# Altium project ChassisPowerDistribution_B_2.0_RW.PrjPcb
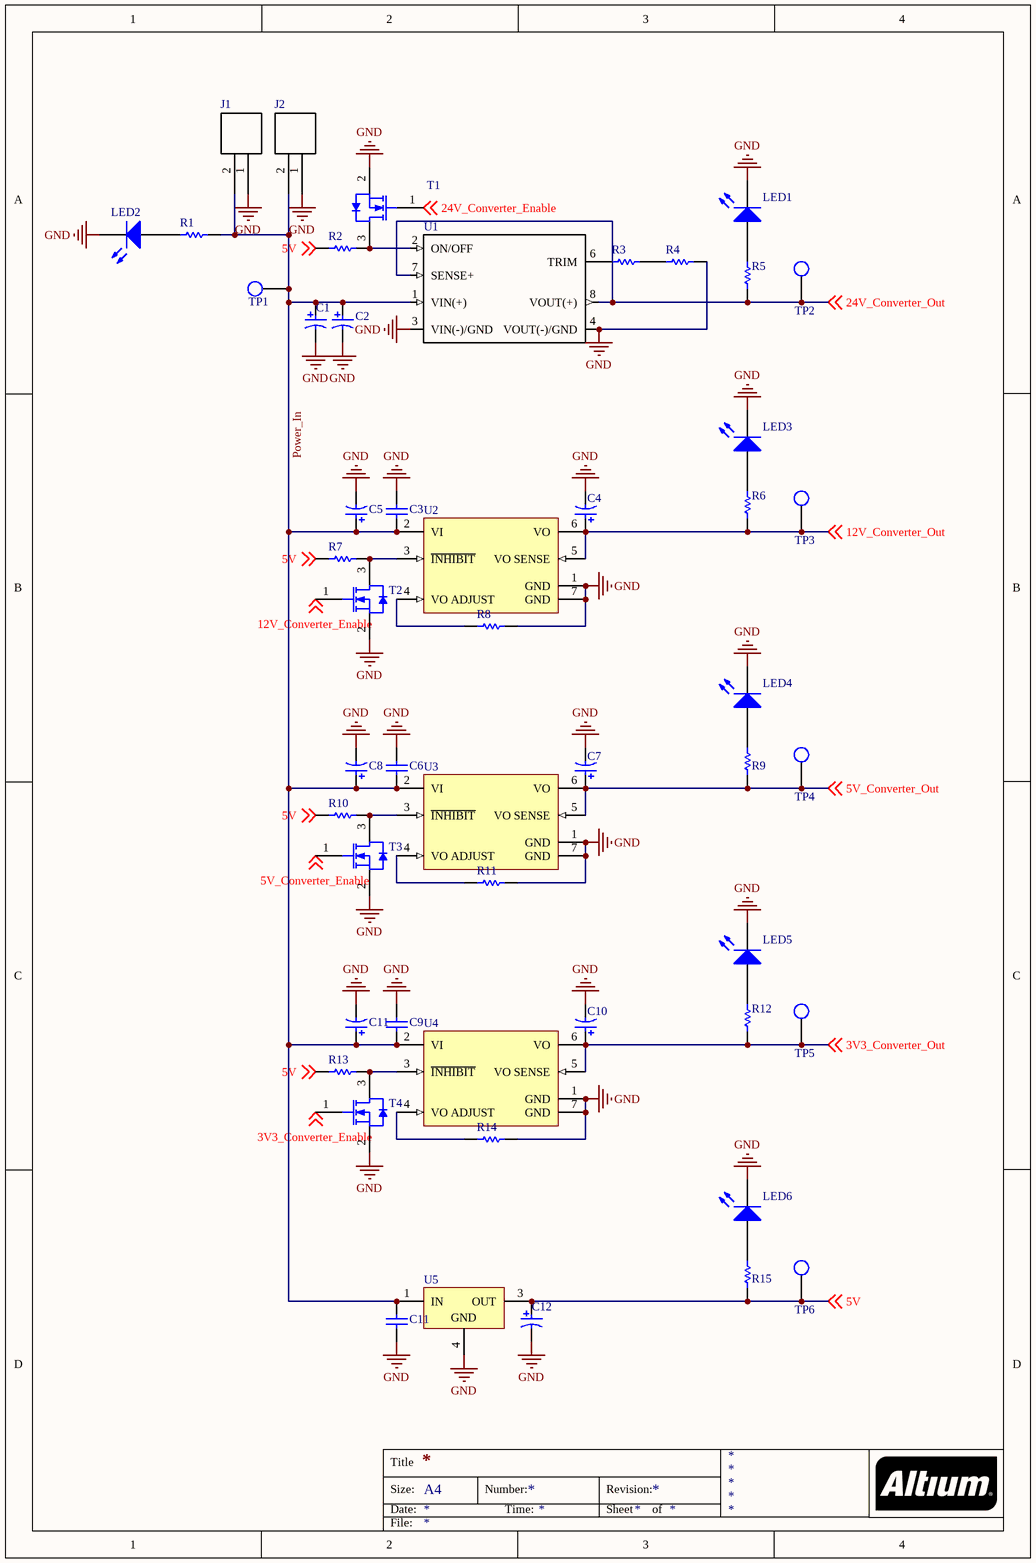
[diagram p0: Converters.SchDoc]
4 sheets, 101 parts. Net scope: global (net labels, ports and power ports of the same name join across sheets).
Sheets:
  Converters.SchDoc
  Current Sensors.SchDoc
  Microcontroller.SchDoc
  Output Connectors.SchDoc

## Sheet Converters.SchDoc
size A4 portrait

### Parts
(Parts that share a designator on the sheet are numbered #1, #2 ... from top to bottom, then left to right.)
C1  EEU-FC1V101  [*CAPPRD350W60D800H2000]  (value not drawn)
C2  ECA1HM100  [CAPPR55-200-1100X500X1200]  (value not drawn)
C3  2.2µF  [Cap 0805]  (value not drawn)
C4  EEU-FC1V331B  [*CAPPRD350W60D800H2000]  (value not drawn)
C5  ECA1HM100  [CAPPR55-200-1100X500X1200]  (value not drawn)
C6  2.2µF  [Cap 0805]  (value not drawn)
C7  EEU-FC1V331B  [*CAPPRD350W60D800H2000]  (value not drawn)
C8#1  ECA1HM100  [CAPPR55-200-1100X500X1200]  (value not drawn)
C9#1  2.2µF  [Cap 0805]  (value not drawn)
C10#1  EEU-FC1V331B  [*CAPPRD350W60D800H2000]  (value not drawn)
C11#1  ECA1HM100  [CAPPR55-200-1100X500X1200]  (value not drawn)
C11#2  0.1μF  [Cap 0805]  (value not drawn)
C12  EEU-FC1V101  [*CAPPRD350W60D800H2000]  (value not drawn)
J1  Super Saber  [Super Sabre]  (value not drawn)
J2  Super Saber  [Super Sabre]  (value not drawn)
LED1  Yellow LED  [0805_A]  (value not drawn)
LED2  Yellow LED  [0805_A]  (value not drawn)
LED3  Yellow LED  [0805_A]  (value not drawn)
LED4  Yellow LED  [0805_A]  (value not drawn)
LED5  Yellow LED  [0805_A]  (value not drawn)
LED6  Yellow LED  [0805_A]  (value not drawn)
R1  1.1k Ohm  [RESC0805(2012)_N]  (value not drawn)
R2  4.7k Ohm  [RESC0805(2012)_N]  (value not drawn)
R3  590 Ohm  [RESC0805(2012)_N]  (value not drawn)
R4  100 Ohm  [RESC0805(2012)_N]  (value not drawn)
R5#1  1.1k Ohm  [RESC0805(2012)_N]  (value not drawn)
R6  510 Ohm  [RESC0805(2012)_N]  (value not drawn)
R7#1  4.7k Ohm  [RESC0805(2012)_N]  (value not drawn)
R8  732 Ohm  [RESC0805(2012)_N]  (value not drawn)
R9  150 Ohm  [RESC0805(2012)_N]  (value not drawn)
R10#1  4.7k Ohm  [RESC0805(2012)_N]  (value not drawn)
R11  21k Ohm  [RESC0805(2012)_N]  (value not drawn)
R12  56 Ohm  [RESC0805(2012)_N]  (value not drawn)
R13#1  4.7k Ohm  [RESC0805(2012)_N]  (value not drawn)
R14  78.7k Ohm  [RESC0805(2012)_N]  (value not drawn)
R15  150 Ohm  [RESC0805(2012)_N]  (value not drawn)
T1  2N7002-7-F  [DIOD-SOT23-3_V]  (value not drawn)
T2  2N7002-7-F  [DIOD-SOT23-3_V]  (value not drawn)
T3  2N7002-7-F  [DIOD-SOT23-3_V]  (value not drawn)
T4  2N7002-7-F  [DIOD-SOT23-3_V]  (value not drawn)
TP1  Test Point  [Test Point Through-hole]  (value not drawn)
TP2  Test Point  [Test Point Through-hole]  (value not drawn)
TP3  Test Point  [Test Point Through-hole]  (value not drawn)
TP4  Test Point  [Test Point Through-hole]  (value not drawn)
TP5  Test Point  [Test Point Through-hole]  (value not drawn)
TP6  Test Point  [Test Point Through-hole]  (value not drawn)
U1#1  I6A4W020A033V-001-R  [*TDK-LAMBDA_I6A4W020A033V-001-R]  (value not drawn)
U2#1  PTN78020WAH  [EUK0007A]  (value not drawn)
U3  PTN78020WAH  [EUK0007A]  (value not drawn)
U4  PTN78020WAH  [EUK0007A]  (value not drawn)
U5#1  TL720M05QKVURQ1  [KVU0003A_M]  (value not drawn)

### Nets
GND: C1.2 C2.2 C3.2 C4.2 C5.2 C6.2 C7.2 C8#1.2 C9#1.2 C10#1.2 C11#1.2 C11#2.1 C12.2 J1.1 J2.1 LED1.1(K) LED2.1(K) LED3.1(K) LED4.1(K) LED5.1(K) LED6.1(K) R4.2 R8.2 R11.2 R14.2 T1.2(S) T2.2(S) T3.2(S) T4.2(S) U1#1.3(VIN(-)/GND) U1#1.4(VOUT(-)/GND) U2#1.1(GND) U2#1.7(GND) U3.1(GND) U3.7(GND) U4.1(GND) U4.7(GND) U5#1.4(GND)
3V3_Converter_Enable: T4.1(G) ; off-sheet 3V3_Converter_Enable
3V3_Converter_Out: C10#1.1 R12.1 TP5.1 U4.5(VO_SENSE) U4.6(VO) ; off-sheet 3V3_Converter_Out
5V: C12.1 R2.1 R7#1.1 R10#1.1 R13#1.1 R15.1 TP6.1 U5#1.3(OUT) ; off-sheet 5V
5V_Converter_Enable: T3.1(G) ; off-sheet 5V_Converter_Enable
5V_Converter_Out: C7.1 R9.1 TP4.1 U3.5(VO_SENSE) U3.6(VO) ; off-sheet 5V_Converter_Out
12V_Converter_Enable: T2.1(G) ; off-sheet 12V_Converter_Enable
12V_Converter_Out: C4.1 R6.2 TP3.1 U2#1.5(VO_SENSE) U2#1.6(VO) ; off-sheet 12V_Converter_Out
24V_Converter_Enable: T1.1(G) ; off-sheet 24V_Converter_Enable
24V_Converter_Out: R5#1.1 TP2.1 U1#1.7(SENSE+) U1#1.8(VOUT(+)) ; off-sheet 24V_Converter_Out
Power_In: C1.1 C2.1 C3.1 C5.1 C6.1 C8#1.1 C9#1.1 C11#1.1 C11#2.2 J1.2 J2.2 R1.2 TP1.1 U1#1.1(VIN(+)) U2#1.2(VI) U3.2(VI) U4.2(VI) U5#1.1(IN)
NetLED1_2: LED1.2(A) R5#1.2
NetLED2_2: LED2.2(A) R1.1
NetLED3_2: LED3.2(A) R6.1
NetLED4_2: LED4.2(A) R9.2
NetLED5_2: LED5.2(A) R12.2
NetLED6_2: LED6.2(A) R15.2
NetR2_2: R2.2 T1.3(D) U1#1.2(ON/OFF)
NetR3_1: R3.1 U1#1.6(TRIM)
NetR3_2: R3.2 R4.1
NetR7#1_2: R7#1.2 T2.3(D) U2#1.3(~{INHIBIT})
NetR8_1: R8.1 U2#1.4(VO_ADJUST)
NetR10#1_2: R10#1.2 T3.3(D) U3.3(~{INHIBIT})
NetR11_1: R11.1 U3.4(VO_ADJUST)
NetR13#1_2: R13#1.2 T4.3(D) U4.3(~{INHIBIT})
NetR14_1: R14.1 U4.4(VO_ADJUST)

### Notes on the sheet
- Title
- Size:
- Date:
- A4
- Number:
- Time:
- Revision:
- Sheet
- of
- File:

### Library data of the parts
C1 C12 = PNSC-CAP-P-2: Aluminum Electrolytic Capacitor, 100 uF +/- 20%, 35 V, -55 to 105 degC, 2-Pin 8 x 8 x 11.5 mm Through-hole, RoHS, Tape and Reel; Manufacturer: Panasonic; Ripple Current: 555 mA; Rated Voltage: 35 V; Cap.: 100 uF; Capacitance Tolerance: +/- 20%; ComponentLink2URL: http://industrial.panasonic.com/www-cgi/jvcr13pz.cgi?E+PZ+3+ABA0022+EEUFC1V101+7+WW; Mounting Technology: Through Hole; ComponentLink3URL: http://industrial.panasonic.com/www-data/pdf/ABA0000/ABA0000PE245.pdf; ComponentLink2Description: Datasheet; PartNumber: EEU-FC1V101; PackageDescription: 2-Pin Through-hole, Base 8 x 8 mm, Height 11.5 mm; PackageReference: EEU-FC1V101; ComponentLink1URL: http://industrial.panasonic.com/; Temp. Range: -55 to 105 degC; RoHS: TRUE; Packing: Tape and Reel; ComponentLink1Description: Manufacturer URL; ComponentLink3Description: Package Specification
C2 C5 C8#1 C11#1 = CMP-2100-03622-1: Aluminum Electrolytic Capacitor, 10 uF, +/- 20%, 50 V, -40 to 85 degC, 2-Pin THD, RoHS, Bulk; Manufacturer: Panasonic; Life (Hours): 2000Hour; Lead/Base Style: Straight; Dissipation Factor: 0.12%; Capacitance: 10uF; Leakage Current: 3uA; Dielectric Material: Aluminium; Lead Diameter: 0.5mm; Voltage Rating: 50V; Ripple Current: 65mA; Package Reference: CAPPR55-200-1100X500X1200; Height: 11mm; Diameter: 5mm; REACH SVHC: NoSVHC; Mount: ThroughHole; Packaging: Bulk; Manufacturer URL: http://www.panasonic.com/; Termination: Radial; Datasheet URL: https://industrial.panasonic.com/cdbs/www-data/pdf/RDF0000/ABA0000C1218.pdf; Lead Free: LeadFree; Height - Seated (Max): 0.472inch; Case/Package: Radial; Package Description: 2-Pin Radial Lead, Dia 5 mm, Height 12 mm; Tolerance: 20%; Datasheet Version: Rev. 05, 10/2016; Package Quantity: 200; Ripple Current (AC): 65mA; Min Operating Temperature: -40degC; RoHSCompliant: true; Number of Pins: 2; Max Operating Temperature: 85degC; Voltage: 50V; Lead Pitch: 2mm; Radiation Hardening: No; Voltage Rating (DC): 50V; Length: 11mm
C3 C6 C9#1 = Capacitor 0805: Standard Capacitor; Manufacturer: AVX; Tolerance (%): ±10%; Dielectric: X5R; Rated Voltage: 10V; Datasheet Version: 05/2016; Manufacturer URL: http://www.avx.com/; Package Description: 2-Pin Surface Mount Device, Body 2.01 x 1.25 mm; Mounting Technology: SurfaceMount; Case Size/Dimension: 0805; Package Reference: 0805; Capacitance: 2.2µF; Datasheet URL: http://datasheets.avx.com/cx5r.pdf
C4 C7 C10#1 = PNSC-CAP-P-2: Aluminum Electrolytic Capacitor, 330 uF +/- 20%, 35 V, -55 to 105 degC, 2-Pin 10 x 10 x 17 mm Through-hole, RoHS, Cut Tape; Manufacturer: Panasonic; Ripple Current: 1.05 A; Rated Voltage: 35 V; Cap.: 330 uF; Capacitance Tolerance: +/- 20%; ComponentLink2URL: http://industrial.panasonic.com/www-cgi/jvcr13pz.cgi?E+PZ+3+ABA0022+EEUFC1V101+7+WW; Mounting Technology: Through Hole; ComponentLink3URL: http://industrial.panasonic.com/www-data/pdf/ABA0000/ABA0000PE245.pdf; ComponentLink2Description: Datasheet; PartNumber: EEU-FC1V331B; PackageDescription: 2-Pin Through-hole, Base 10 x 10 mm, Height 17 mm; PackageReference: EEU-FC1V331B; ComponentLink1URL: http://industrial.panasonic.com/; Temp. Range: -55 to 105 degC; RoHS: TRUE; Packing: Cut Tape; ComponentLink1Description: Manufacturer URL; ComponentLink3Description: Package Specification
C11#2 = Capacitor 0805: Standard Capacitor; Mounting Technology: SurfaceMount; Case Size/Dimension: 0805; Package Reference: 0805; Capacitance: 0.1μF
LED1-LED6 = LED: Standard 0805 LED; PackageReference: 0805_A; Color: Yellow
R1-R4 R5#1 R6 R7#1 R8 R9 R10#1 R11 R13#1 R14 R15 = Resistor 0805: Generic 0805 Resistor; Case-EIA: 0805; Technology: SMT
  R1 R5#1: Value: 1.1k Ohm
  R2 R7#1 R10#1 R13#1: Value: 4.7k Ohm
  R3: Value: 590 Ohm
  R4: Value: 100 Ohm
  R6: Value: 510 Ohm
  R8: Value: 732 Ohm
  R9 R15: Value: 150 Ohm
  R11: Value: 21k Ohm
  R14: Value: 78.7k Ohm
R12 = Resistor 0805: Generic 0805 Resistor; Tolerance: 5 %; Case-EIA: 0805; Power: 0.125 W; Technology: SMT; Value: 56 Ohm
T1-T4 = CMP-2000-04929-1: N-Channel Enhancement Mode Field Effect Transistor, 60 V, 0.115 A, -55 to 150 degC, 3-Pin SOT23, RoHS, Tape and Reel; Id - Continuous Drain Current: 115mA; Typical Turn-On Delay Time: 7ns; Typical Turn-Off Delay Time: 11ns; Brand: DiodesIncorporated; Transistor Type: 1N-Channel; Vgs - Gate-Source Voltage: 20V; Rise Time: 3ns; Configuration: Single; Fall Time: 5.6ns; Vds - Drain-Source Breakdown Voltage: 70V; Rds On - Drain-Source Resistance: 7.5Ohms; Number of Channels: 1Channel; Forward Transconductance - Min: 0.08S; Pd - Power Dissipation: 300mW; Unit Weight: 0.000282oz; Datasheet URL: http://datasheet.octopart.com/2N7002-7-F-Diodes-Inc.-datasheet-8326113.pdf; Width: 1.3mm; Series: 2N7002; Length: 2.9mm; Product Category: MOSFET; Minimum Operating Temperature: -55C; Manufacturer URL: http://www.diodes.com/; Mounting Style: SMD/SMT; Package Reference: SOT23-3; Package Description: 3-Pin Small Outline Transistor, Body 2.9 x 1.3 mm, Pitch 0.96 mm; Maximum Operating Temperature: +150C; Transistor Polarity: N-Channel; Factory Pack Quantity: 3000; Technology: Si; Channel Mode: Enhancement; Datasheet Version: Rev. 21-2, 02/2009; Type: EnhancementModeFieldEffectTransistor; RoHS: True; Packaging: Reel; Package / Case: SOT-23-3; Height: 1mm; Product: MOSFETSmallSignal; Manufacturer: DiodesIncorporated
U1#1 = I6A4W020A033V-001-R: Dc-Dc, Pcb Mount, Sixteenth Brick, Input 24vdc, Output 3.3-15v 20a, 250w, Neg Logic; MF: TDK-Lambda Americas; SnapEDA_Link: https://www.snapeda.com/parts/I6A4W020A033V-001-R/TDK-Lambda%20Americas%20Inc./view-part/?ref=snap; Digi-Key_Part_Number: 285-2503-ND; MP: I6A4W020A033V-001-R; Package: DIP-7 TDK-Lambda; Digi-Key_Purchase_URL: https://www.digikey.com/product-detail/en/tdk-lambda-americas-inc/I6A4W020A033V-001-R/285-2503-ND/5878834?utm_source=snapeda&utm_medium=aggregator&utm_campaign=symbol; Value: *
U2#1 U3 U4 = CMP-0387-00547-2: 6 A Wide-Input Voltage Adjustable Switching Regulator, -40 to 85 degC, 7-pin Module (EUK7), Pb-Free (RoHS); Manufacturer: Texas Instruments; Vout(Min)(V): 2.5; Vin(Max)(V): 36; Vout(Max)(V): 12.6; Vin(Min)(V): 7; VO Adjustable: TRUE; SubFamily: Non-Isolated POL; Regulated Outputs(#): 1; Iout(Max)(A): 6; ComponentLink3Description: Package Specification; ComponentLink3URL: http://www.ti.com/litv/pdf/mpds185; PackageDescription: 7-Pin Plastic Special Shape, Body 22.1 x 37.97 mm; ComponentLink4URL: Samples URL:http://www.ti.com/product/ptn78020w#samples; DatasheetVersion: SLTS228C; ComponentLink2Description: Datasheet; ComponentLink4Description: URL Link1; ComponentLink1Description: Manufacturer URL; Mounting Technology: Through Hole; Eco-Plan: Pb-Free (RoHS); PartNumber: PTN78020WAH; PackageVersion: 4204986-2/C; ComponentLink2URL: http://www.ti.com/general/docs/lit/getliterature.tsp?genericPartNumber=PTN78020W&fileType=pdf; PackageReference: EUK0007A; ComponentLink1URL: http://www.ti.com/
U5#1 = CMP-0395-01074-2: Single Output Automotive LDO, 700 mA, Fixed 5 V Output, 5.5 to 42 V Input, 3-pin PFM (KVU), -40 to 125 degC, Green (RoHS & no Sb/Br); Manufacturer: Texas Instruments; Vin(Max)(V): 42; Vout Adj(Min)(V): 5; Vin(Min)(V): 5.5; Iq(Typ)(mA): 12; SubFamily: Single Channel LDO; Accuracy(%): 3; Vdo(Typ)(mV): 250; Iout(Max)(A): 0.7; Mounting Technology: Surface Mount; ComponentLink1Description: Manufacturer URL; Code_JEDEC: TO-252; ComponentLink3URL: http://www.ti.com/litv/pdf/mpsf018c; Fixed Output Options(V): 5; ComponentLink2URL: http://www.ti.com/general/docs/lit/getliterature.tsp?genericPartNumber=TL720M05-Q1&fileType=pdf; ComponentLink2Description: Datasheet; ComponentLink3Description: Package Specification; PackageReference: KVU0003A; PackageVersion: 4205521-2/D; PartNumber: TL720M05QKVURQ1; PackageDescription: 3-Pin Plastic Flange Mount, Body 6.1 x 6.6 mm, Pitch 2.29 mm; DatasheetVersion: SGLS380D; Eco-Plan: Green (RoHS & no Sb/Br); ComponentLink1URL: http://www.ti.com/; Vout Adj(Max)(V): 5

## Sheet Current Sensors.SchDoc
size A4
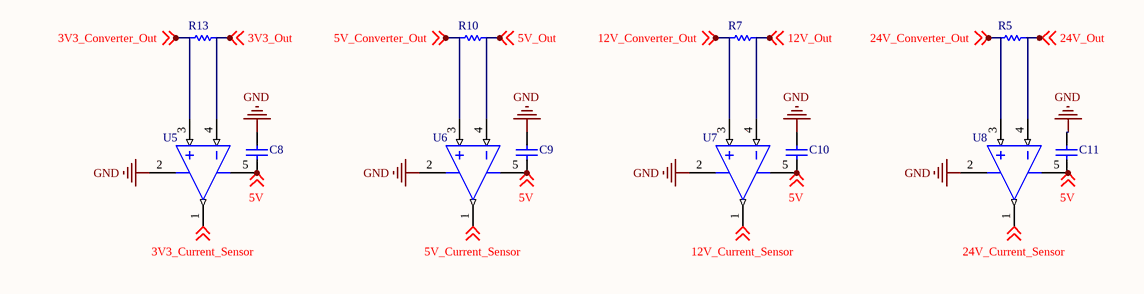
[diagram p1: Current Sensors.SchDoc]

### Parts
(Parts that share a designator on the sheet are numbered #1, #2 ... from top to bottom, then left to right.)
C8#2  0.1μF  [Cap 0805]  (value not drawn)
C9#2  0.1μF  [Cap 0805]  (value not drawn)
C10#2  0.1μF  [Cap 0805]  (value not drawn)
C11#3  0.1μF  [Cap 0805]  (value not drawn)
R5#2  10 mOhms  [RESC0805(2012)_N]  (value not drawn)
R7#2  15 mOhms  [RESC0805(2012)_N]  (value not drawn)
R10#2  20 mOhms  [RESC0805(2012)_N]  (value not drawn)
R13#2  25 mOhms  [RESC0805(2012)_N]  (value not drawn)
U5#2  INA194AIDBVR  [DBV0005A_L]  (value not drawn)
U6  INA194AIDBVR  [DBV0005A_L]  (value not drawn)
U7  INA194AIDBVR  [DBV0005A_L]  (value not drawn)
U8  INA194AIDBVR  [DBV0005A_L]  (value not drawn)

### Nets
GND: C8#2.2 C9#2.2 C10#2.2 C11#3.2 U5#2.2(GND) U6.2(GND) U7.2(GND) U8.2(GND)
3V3_Converter_Out: R13#2.1 U5#2.3(VIN+) ; off-sheet 3V3_Converter_Out
3V3_Current_Sensor: U5#2.1(OUT) ; off-sheet 3V3_Current_Sensor
3V3_Out: R13#2.2 U5#2.4(VIN-) ; off-sheet 3V3_Out
5V: C8#2.1 C9#2.1 C10#2.1 C11#3.1 U5#2.5(V+) U6.5(V+) U7.5(V+) U8.5(V+) ; off-sheet 5V
5V_Converter_Out: R10#2.1 U6.3(VIN+) ; off-sheet 5V_Converter_Out
5V_Current_Sensor: U6.1(OUT) ; off-sheet 5V_Current_Sensor
5V_Out: R10#2.2 U6.4(VIN-) ; off-sheet 5V_Out
12V_Converter_Out: R7#2.1 U7.3(VIN+) ; off-sheet 12V_Converter_Out
12V_Current_Sensor: U7.1(OUT) ; off-sheet 12V_Current_Sensor
12V_Out: R7#2.2 U7.4(VIN-) ; off-sheet 12V_Out
24V_Converter_Out: R5#2.1 U8.3(VIN+) ; off-sheet 24V_Converter_Out
24V_Current_Sensor: U8.1(OUT) ; off-sheet 24V_Current_Sensor
24V_Out: R5#2.2 U8.4(VIN-) ; off-sheet 24V_Out

### Notes on the sheet
- Title
- Size:
- Date:
- A4
- Number:
- Time:
- Revision:
- Sheet
- of
- File:

### Library data of the parts
C8#2 C9#2 C10#2 C11#3 = Capacitor 0805: Standard Capacitor; Mounting Technology: SurfaceMount; Case Size/Dimension: 0805; Package Reference: 0805; Capacitance: 0.1μF
R5#2 R7#2 R10#2 R13#2 = Resistor 0805: Generic 0805 Resistor; Case-EIA: 0805; Technology: SMT
  R5#2: Value: 10 mOhms
  R7#2: Value: 15 mOhms
  R10#2: Value: 20 mOhms
  R13#2: Value: 25 mOhms
U5#2 U6-U8 = TI-INA1XXDBV5: Voltage Output High-Side Measurement Current Shunt Monitor, 2.7 to 18 V, -40 to 125 degC, 5-pin SOT23 (DBV5), Green (RoHS & no Sb/Br); Manufacturer: Texas Instruments; Quiescent Current (+/-)(Typ)(mA): 0.7; Input Offset (+/-)(Max)(uV): 2000; Gain(V/V): 50; Vs(Min)(V): 2.7; Rating: Catalog; Small-Signal Bandwidth(Typ)(MHz): 0.3; CMRR(Min)(dB): 80; Common Mode Range(Min)(V): -16; Vs(Max)(V): 18; ComponentLink2Description: Datasheet; Eco-Plan: Green (RoHS & no Sb/Br); ComponentLink1URL: http://www.ti.com/; Code_JEDEC: MO-178; SubFamily: Current Shunt Monitor; ComponentLink3URL: http://www.ti.com/lit/ml/mpds018j/mpds018j.pdf; PackageVersion: 4073253-4/K, 03/2006; PartNumber: INA194AIDBVR; DatasheetVersion: SBOS307F; ComponentLink1Description: Manufacturer URL; ComponentLink3Description: Package Specification; Output Type: Voltage; Mounting Technology: Surface Mount; ComponentLink2URL: http://www.ti.com/general/docs/lit/getliterature.tsp?genericPartNumber=INA194&fileType=pdf; Common Mode Range(Max)(V): 80; PackageDescription: 5-Pin Plastic Small Outline, Body 1.6 x 2.9 mm, Pitch 0.95 mm; PackageReference: DBV0005A

## Sheet Microcontroller.SchDoc
size A
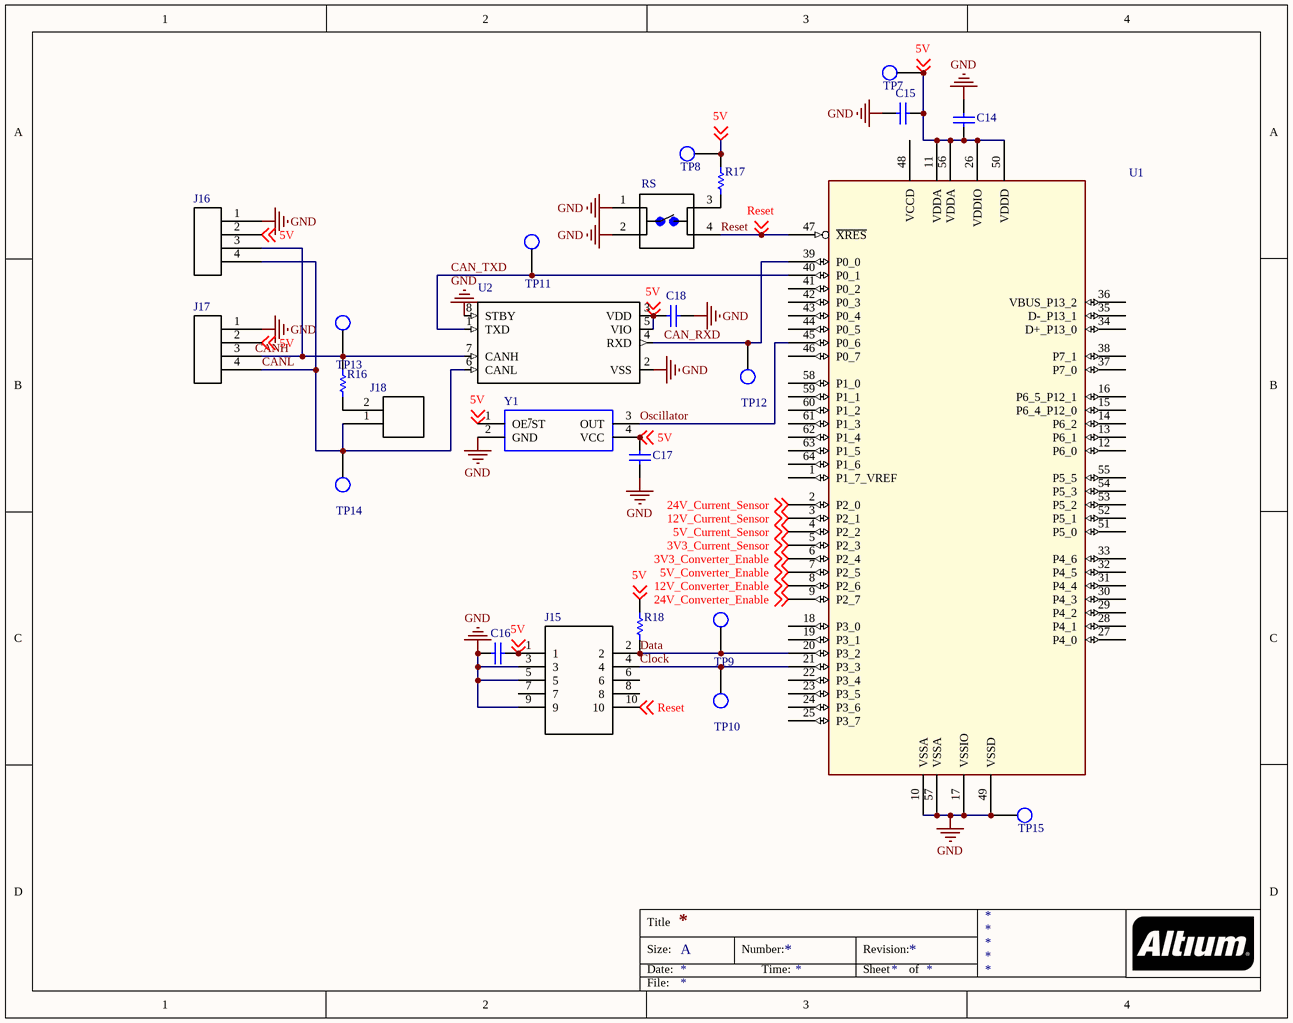
[diagram p2: Microcontroller.SchDoc]

### Parts
(Parts that share a designator on the sheet are numbered #1, #2 ... from top to bottom, then left to right.)
C14  10 μF  [Cap 0805]  (value not drawn)
C15  0.1 μF  [Cap 0805]  (value not drawn)
C16  0.1 μF  [Cap 0805]  (value not drawn)
C17  0.1 μF  [Cap 0805]  (value not drawn)
C18  0.1 μF  [Cap 0805]  (value not drawn)
J15  Programming Header  [programming]  (value not drawn)
J16  Molex Micro  [microfit 4 pin]  (value not drawn)
J17  Molex Micro  [microfit 4 pin]  (value not drawn)
J18  Molex micro-  [Microfit 2 pin]  (value not drawn)
R16  120R  [RESC0805(2012)_N]  (value not drawn)
R17  4.7 kOhm  [RESC0805(2012)_N]  (value not drawn)
R18  47 kOhm  [RESC0805(2012)_N]  (value not drawn)
RS  1825910-7  [Switch 6mm 24V (NO)]  (value not drawn)
TP7  Test Point  [Test Point Through-hole]  (value not drawn)
TP8  Test Point  [Test Point Through-hole]  (value not drawn)
TP9  Test Point  [Test Point Through-hole]  (value not drawn)
TP10  Test Point  [Test Point Through-hole]  (value not drawn)
TP11  Test Point  [Test Point Through-hole]  (value not drawn)
TP12  Test Point  [Test Point Through-hole]  (value not drawn)
TP13  Test Point  [Test Point Through-hole]  (value not drawn)
TP14  Test Point  [Test Point Through-hole]  (value not drawn)
TP15  Test Point  [Test Point Through-hole]  (value not drawn)
U1#2  CY8C4248AZI-L485  [TQFP50P1200X1200X160-64N]  (value not drawn)
U2#2  MCP2562-E/SN  [SOIC127P600X175-8N]  (value not drawn)
Y1  SG-636PCW_50.0000MC3__ROHS  [SG-636]  (value not drawn)

### Nets
GND: C14.2 C15.2 C16.2 C17.1 C18.1 J15.3 J15.5 J15.9 J16.1 J17.1 RS.1 RS.2 TP15.1 U1#2.10(VSSA) U1#2.17(VSSIO) U1#2.49(VSSD) U1#2.57(VSSA) U2#2.2(VSS) U2#2.8(STBY) Y1.2(GND)
3V3_Converter_Enable: U1#2.6(P2_4) ; off-sheet 3V3_Converter_Enable
3V3_Current_Sensor: U1#2.5(P2_3) ; off-sheet 3V3_Current_Sensor
5V: C14.1 C15.1 C16.1 C17.2 C18.2 J15.1 J16.2 J17.2 R17.2 R18.2 TP7.1 TP8.1 U1#2.11(VDDA) U1#2.26(VDDIO) U1#2.50(VDDD) U1#2.56(VDDA) U2#2.3(VDD) U2#2.5(VIO) Y1.1(OE~{/}ST) Y1.4(VCC) ; off-sheet 5V
5V_Converter_Enable: U1#2.7(P2_5) ; off-sheet 5V_Converter_Enable
5V_Current_Sensor: U1#2.4(P2_2) ; off-sheet 5V_Current_Sensor
12V_Converter_Enable: U1#2.8(P2_6) ; off-sheet 12V_Converter_Enable
12V_Current_Sensor: U1#2.3(P2_1) ; off-sheet 12V_Current_Sensor
24V_Converter_Enable: U1#2.9(P2_7) ; off-sheet 24V_Converter_Enable
24V_Current_Sensor: U1#2.2(P2_0) ; off-sheet 24V_Current_Sensor
CAN_RXD: TP12.1 U1#2.39(P0_0) U2#2.4(RXD)
CAN_TXD: TP11.1 U1#2.40(P0_1) U2#2.1(TXD)
CANL: J16.4 J17.4 J18.1 TP14.1 U2#2.6(CANL)
Clock: J15.4 TP10.1 U1#2.21(P3_3)
Data: J15.2 R18.1 TP9.1 U1#2.20(P3_2)
Oscillator: U1#2.45(P0_6) Y1.3(OUT)
Reset: J15.10 RS.4 U1#2.47(~{XRES}) ; off-sheet Reset
NetJ16_3: J16.3 J17.3 R16.2 TP13.1 U2#2.7(CANH)
NetJ18_2: J18.2 R16.1
NetR17_1: R17.1 RS.3

Not connected (* = marked no-connect by the designer): J15 6 7 8; U1#2 1(P1_7_VREF) 12(P6_0) 13(P6_1) 14(P6_2) 15(P6_4_P12_0) 16(P6_5_P12_1) 18(P3_0) 19(P3_1) 22(P3_4) 23(P3_5) 24(P3_6) 25(P3_7) 27(P4_0) 28(P4_1) 29(P4_2) 30(P4_3) 31(P4_4) 32(P4_5) 33(P4_6) 34(D+_P13_0) 35(D-_P13_1) 36(VBUS_P13_2) 37(P7_0) 38(P7_1) 41(P0_2) 42(P0_3) 43(P0_4) 44(P0_5) 46(P0_7) 48(VCCD) 51(P5_0) 52(P5_1) 53(P5_2) 54(P5_3) 55(P5_5) 58(P1_0) 59(P1_1) 60(P1_2) 61(P1_3) 62(P1_4) 63(P1_5) 64(P1_6)

### Notes on the sheet
- Labels drawn without touching a wire or pin: CANH
- Title
- Size:
- Date:
- A
- Number:
- Time:
- Revision:
- Sheet
- of
- File:

### Library data of the parts
C14-C18 = Capacitor 0805: Standard Capacitor; Mounting Technology: SurfaceMount; Case Size/Dimension: 0805; Package Reference: 0805
  C14: Capacitance: 10 μF
  C15-C18: Capacitance: 0.1 μF
J16 J17 = Molex micro-fit 4-pin (Single row schematic): Molex micro-fit 3.0 dual row header. P/N 0430450427
J18 = Molex micro-fit 2-pin: Molex micro-fit 3.0. Molex P/N 0430450227
R16 = Resistor 0805: Generic 0805 Resistor; Tolerance: 5 %; Case-Metric: 2012; Value: 120.00 Ohm; Case-EIA: 0805; Power: 0.125 W; Technology: SMT
R17 R18 = Resistor 0805: Generic 0805 Resistor; Case-EIA: 0805; Technology: SMT
  R17: Value: 4.7 kOhm
  R18: Value: 47 kOhm
RS = Switch 6mm 24V (NO): FSM4JAH=6MM TACT SWITCH, HIGH TEMP; MF: TE Connectivity; Contact_Current_Rating: 50 mA; Configuration_Pole-Throw: Single Pole - Single Throw; Package: None; Digi-Key_Part_Number: 450-1804-ND; Digi-Key_Purchase_URL: https://www.digikey.com/product-detail/en/te-connectivity-alcoswitch-switches/1825910-7/450-1804-ND/1731414?utm_source=snapeda&utm_medium=aggregator&utm_campaign=symbol; MP: 1825910-7; SnapEDA_Link: https://www.snapeda.com/parts/1825910-7/TE%20Connectivity%20ALCOSWITCH%20Switches/view-part/?ref=snap; EU_RoHS_Compliance: Compliant; TE_purchase_URL: https://www.te.com/usa-en/product-1825910-7.html?te_bu=Cor&te_type=disp&te_campaign=seda_glo_cor-seda-global-disp-prtnr-fy19-seda-model-bom-cta_sma-317_1&elqCampaignId=32493; Value: *
U1#2 = PSOC MC: 64 pin psoc; Part_Number: CY8C4248AZI-L485
U2#2 = CAN Tranceiver: Microchip MCP2562-E/SN, CAN Transceiver 1MBps 1-channel IEC 61000-4-2, 8-Pin SOIC; Price: None; MF: Microchip; SnapEDA_Link: https://www.snapeda.com/parts/MCP2562-E/SN/Microchip/view-part/?ref=snap; MP: MCP2562-E/SN; Availability: Unavailable; Package: SO-8 Microchip; Value: *
Y1 = Oscilator: Standard Clock Oscillators; Manufacturer_Name: Epson Timing; Manufacturer_Part_Number: SG-636PCW 50.0000MC3: ROHS; RS Part Number: *; RS Price/Stock: *; Arrow Part Number: SG-636PCW 50.0000MC3: ROHS; Arrow Price/Stock: *; Datasheet Link: http://www.mouser.com/ds/2/137/G-636PCE_en-1003252.pdf

## Sheet Output Connectors.SchDoc
size A4 portrait
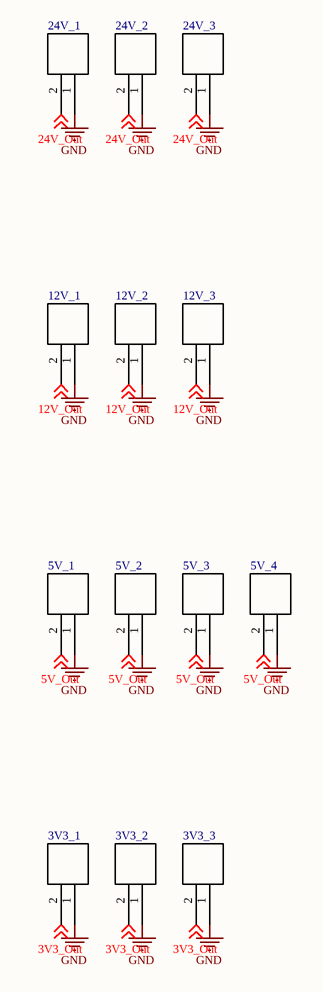
[diagram p3: Output Connectors.SchDoc]

### Parts
3V3_1  Molex 6.5MM  power connector  [power connector]  (value not drawn)
3V3_2  Molex 6.5MM  power connector  [power connector]  (value not drawn)
3V3_3  Molex 6.5MM  power connector  [power connector]  (value not drawn)
5V_1  Molex 6.5MM  power connector  [power connector]  (value not drawn)
5V_2  Molex 6.5MM  power connector  [power connector]  (value not drawn)
5V_3  Molex 6.5MM  power connector  [power connector]  (value not drawn)
5V_4  Molex 6.5MM  power connector  [power connector]  (value not drawn)
12V_1  Molex 6.5MM  power connector  [power connector]  (value not drawn)
12V_2  Molex 6.5MM  power connector  [power connector]  (value not drawn)
12V_3  Molex 6.5MM  power connector  [power connector]  (value not drawn)
24V_1  Molex 6.5MM  power connector  [power connector]  (value not drawn)
24V_2  Molex 6.5MM  power connector  [power connector]  (value not drawn)
24V_3  Molex 6.5MM  power connector  [power connector]  (value not drawn)

### Nets
GND: 3V3_1.1 3V3_2.1 3V3_3.1 5V_1.1 5V_2.1 5V_3.1 5V_4.1 12V_1.1 12V_2.1 12V_3.1 24V_1.1 24V_2.1 24V_3.1
3V3_Out: 3V3_1.2 3V3_2.2 3V3_3.2 ; off-sheet 3V3_Out
5V_Out: 5V_1.2 5V_2.2 5V_3.2 5V_4.2 ; off-sheet 5V_Out
12V_Out: 12V_1.2 12V_2.2 12V_3.2 ; off-sheet 12V_Out
24V_Out: 24V_1.2 24V_2.2 24V_3.2 ; off-sheet 24V_Out

### Notes on the sheet
- Title
- Size:
- Date:
- A4
- Number:
- Time:
- Revision:
- Sheet
- of
- File:

## Nets that join several sheets
GND: Converters (38 pins), Current Sensors (8 pins), Microcontroller (20 pins), Output Connectors (13 pins)
3V3_Converter_Enable: Converters (T4.1), Microcontroller (U1#2.6)
3V3_Converter_Out: Converters (5 pins), Current Sensors (R13#2.1 U5#2.3)
3V3_Current_Sensor: Current Sensors (U5#2.1), Microcontroller (U1#2.5)
3V3_Out: Current Sensors (R13#2.2 U5#2.4), Output Connectors (3V3_1.2 3V3_2.2 3V3_3.2)
5V: Converters (8 pins), Current Sensors (8 pins), Microcontroller (20 pins)
5V_Converter_Enable: Converters (T3.1), Microcontroller (U1#2.7)
5V_Converter_Out: Converters (5 pins), Current Sensors (R10#2.1 U6.3)
5V_Current_Sensor: Current Sensors (U6.1), Microcontroller (U1#2.4)
5V_Out: Current Sensors (R10#2.2 U6.4), Output Connectors (5V_1.2 5V_2.2 5V_3.2 5V_4.2)
12V_Converter_Enable: Converters (T2.1), Microcontroller (U1#2.8)
12V_Converter_Out: Converters (5 pins), Current Sensors (R7#2.1 U7.3)
12V_Current_Sensor: Current Sensors (U7.1), Microcontroller (U1#2.3)
12V_Out: Current Sensors (R7#2.2 U7.4), Output Connectors (12V_1.2 12V_2.2 12V_3.2)
24V_Converter_Enable: Converters (T1.1), Microcontroller (U1#2.9)
24V_Converter_Out: Converters (R5#1.1 TP2.1 U1#1.7 U1#1.8), Current Sensors (R5#2.1 U8.3)
24V_Current_Sensor: Current Sensors (U8.1), Microcontroller (U1#2.2)
24V_Out: Current Sensors (R5#2.2 U8.4), Output Connectors (24V_1.2 24V_2.2 24V_3.2)